# EAGLE schematic External Diagram FH (EAGLE 9.2.2)
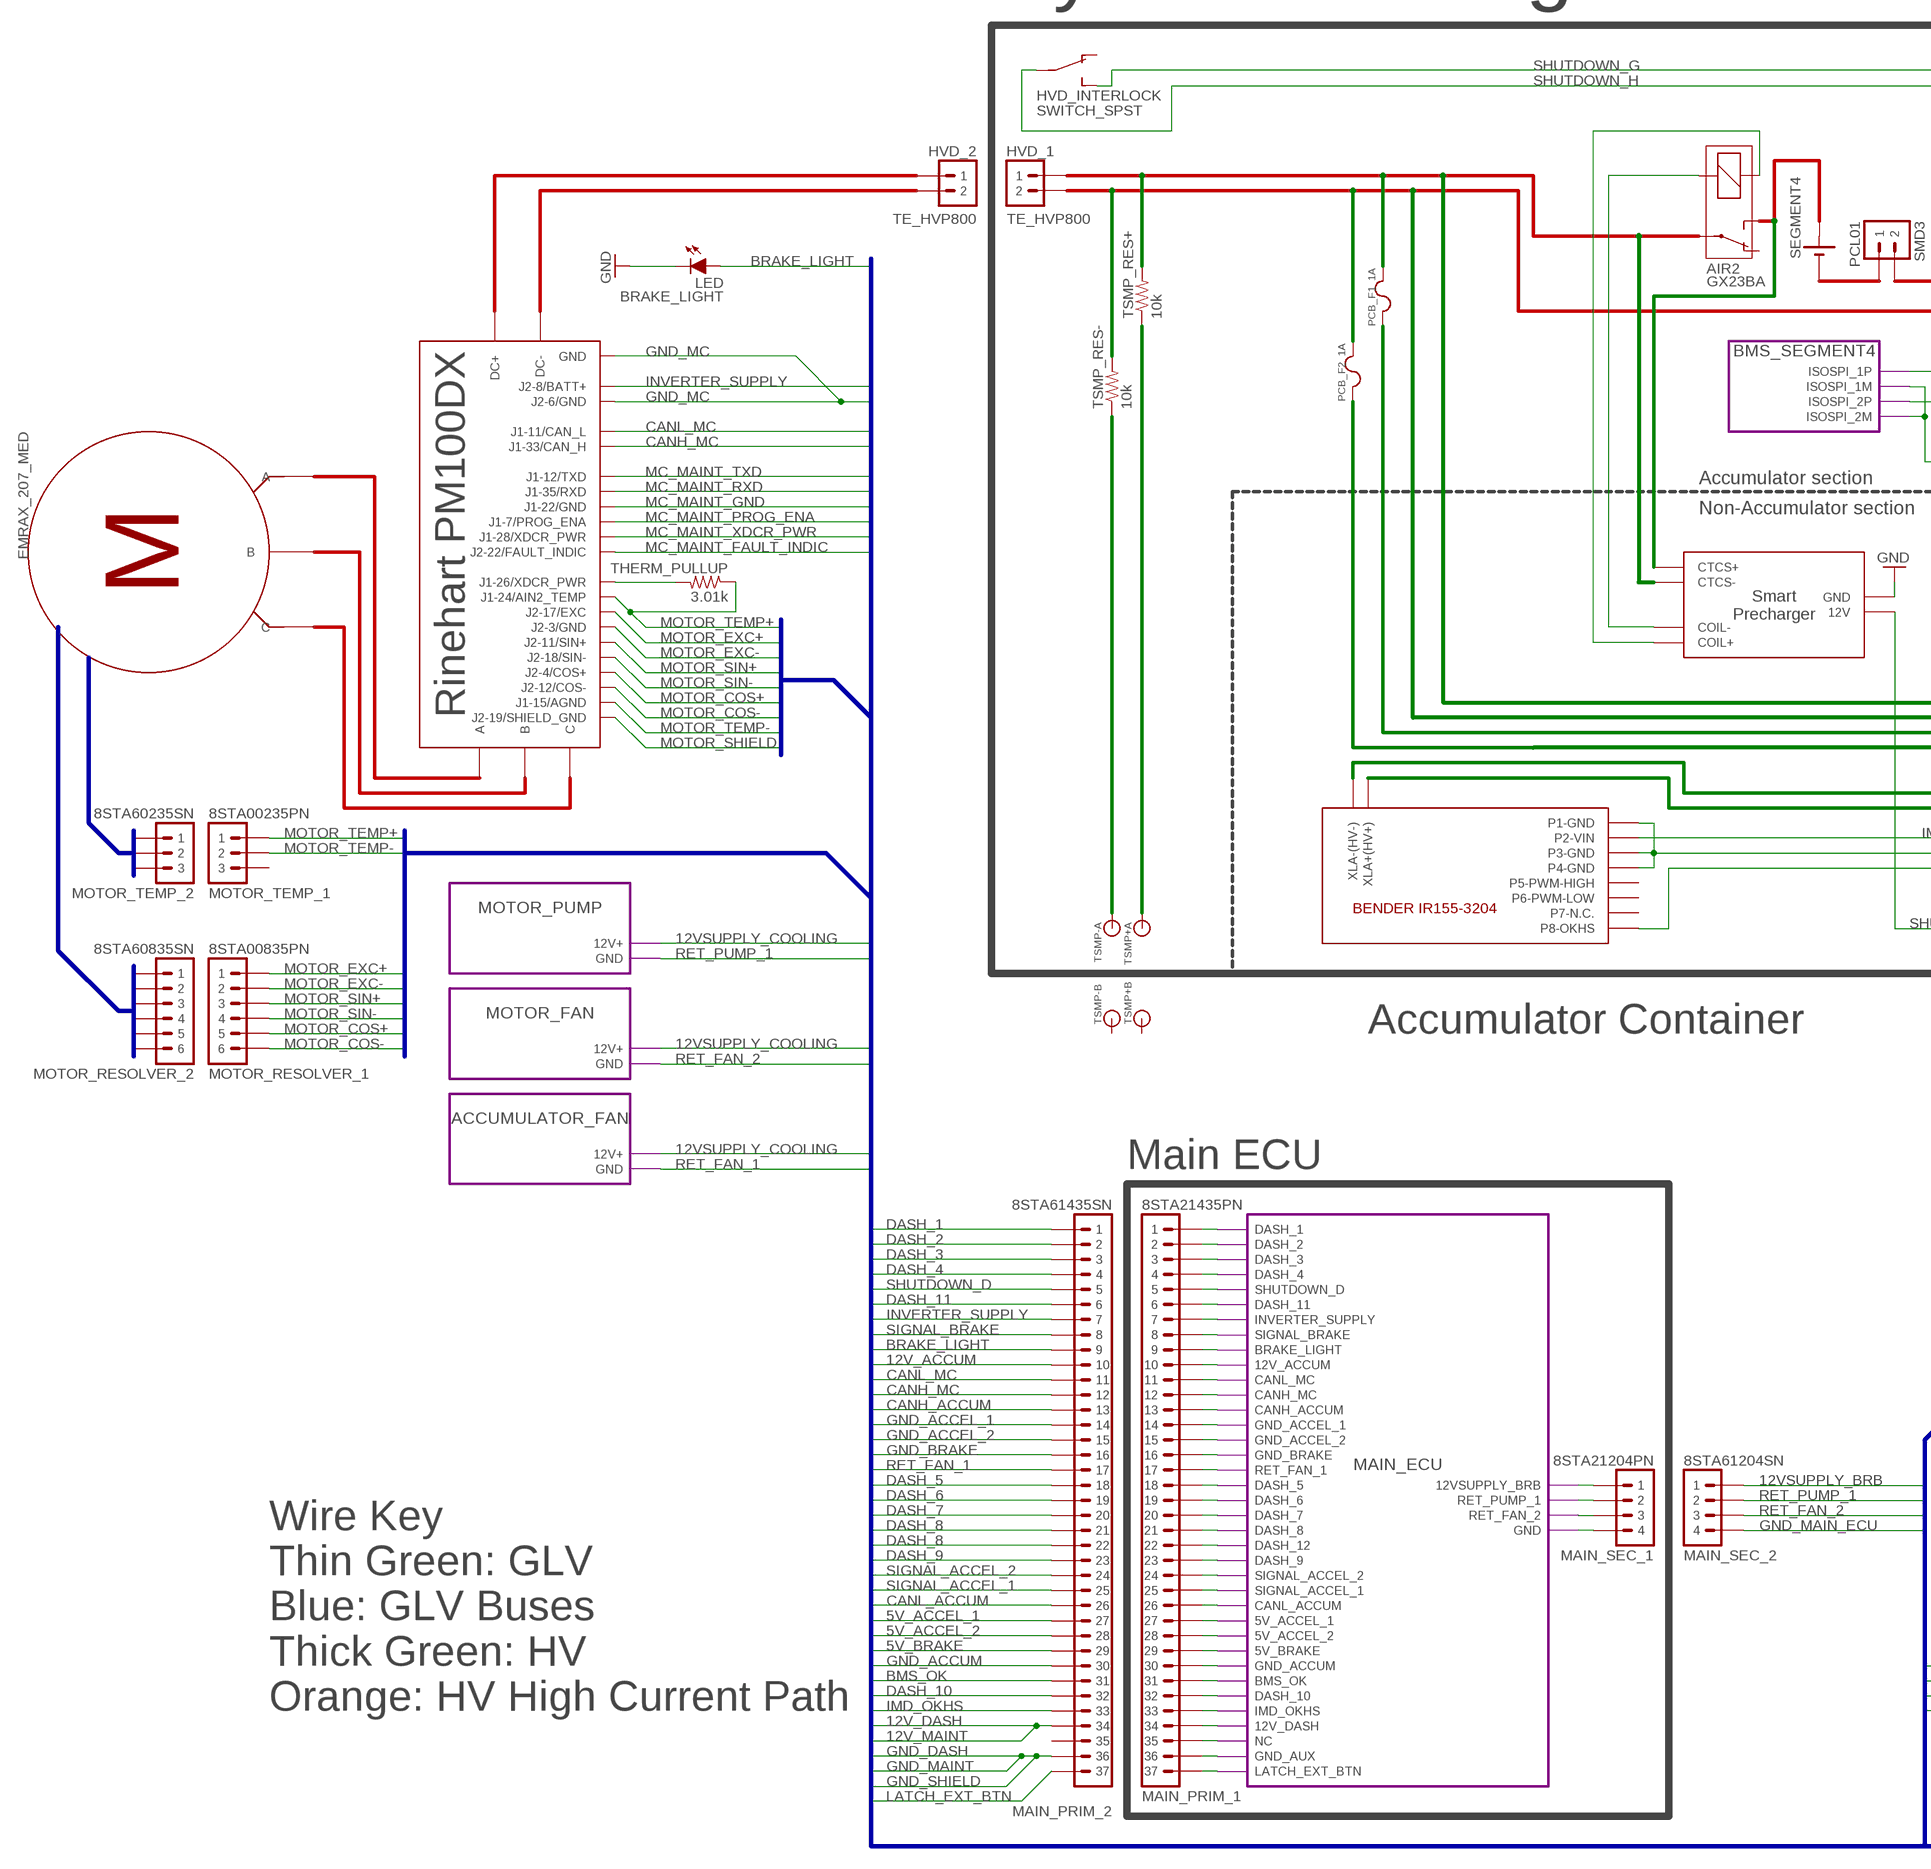
[diagram p0: schematic, sheet 1, part 1 of 2]
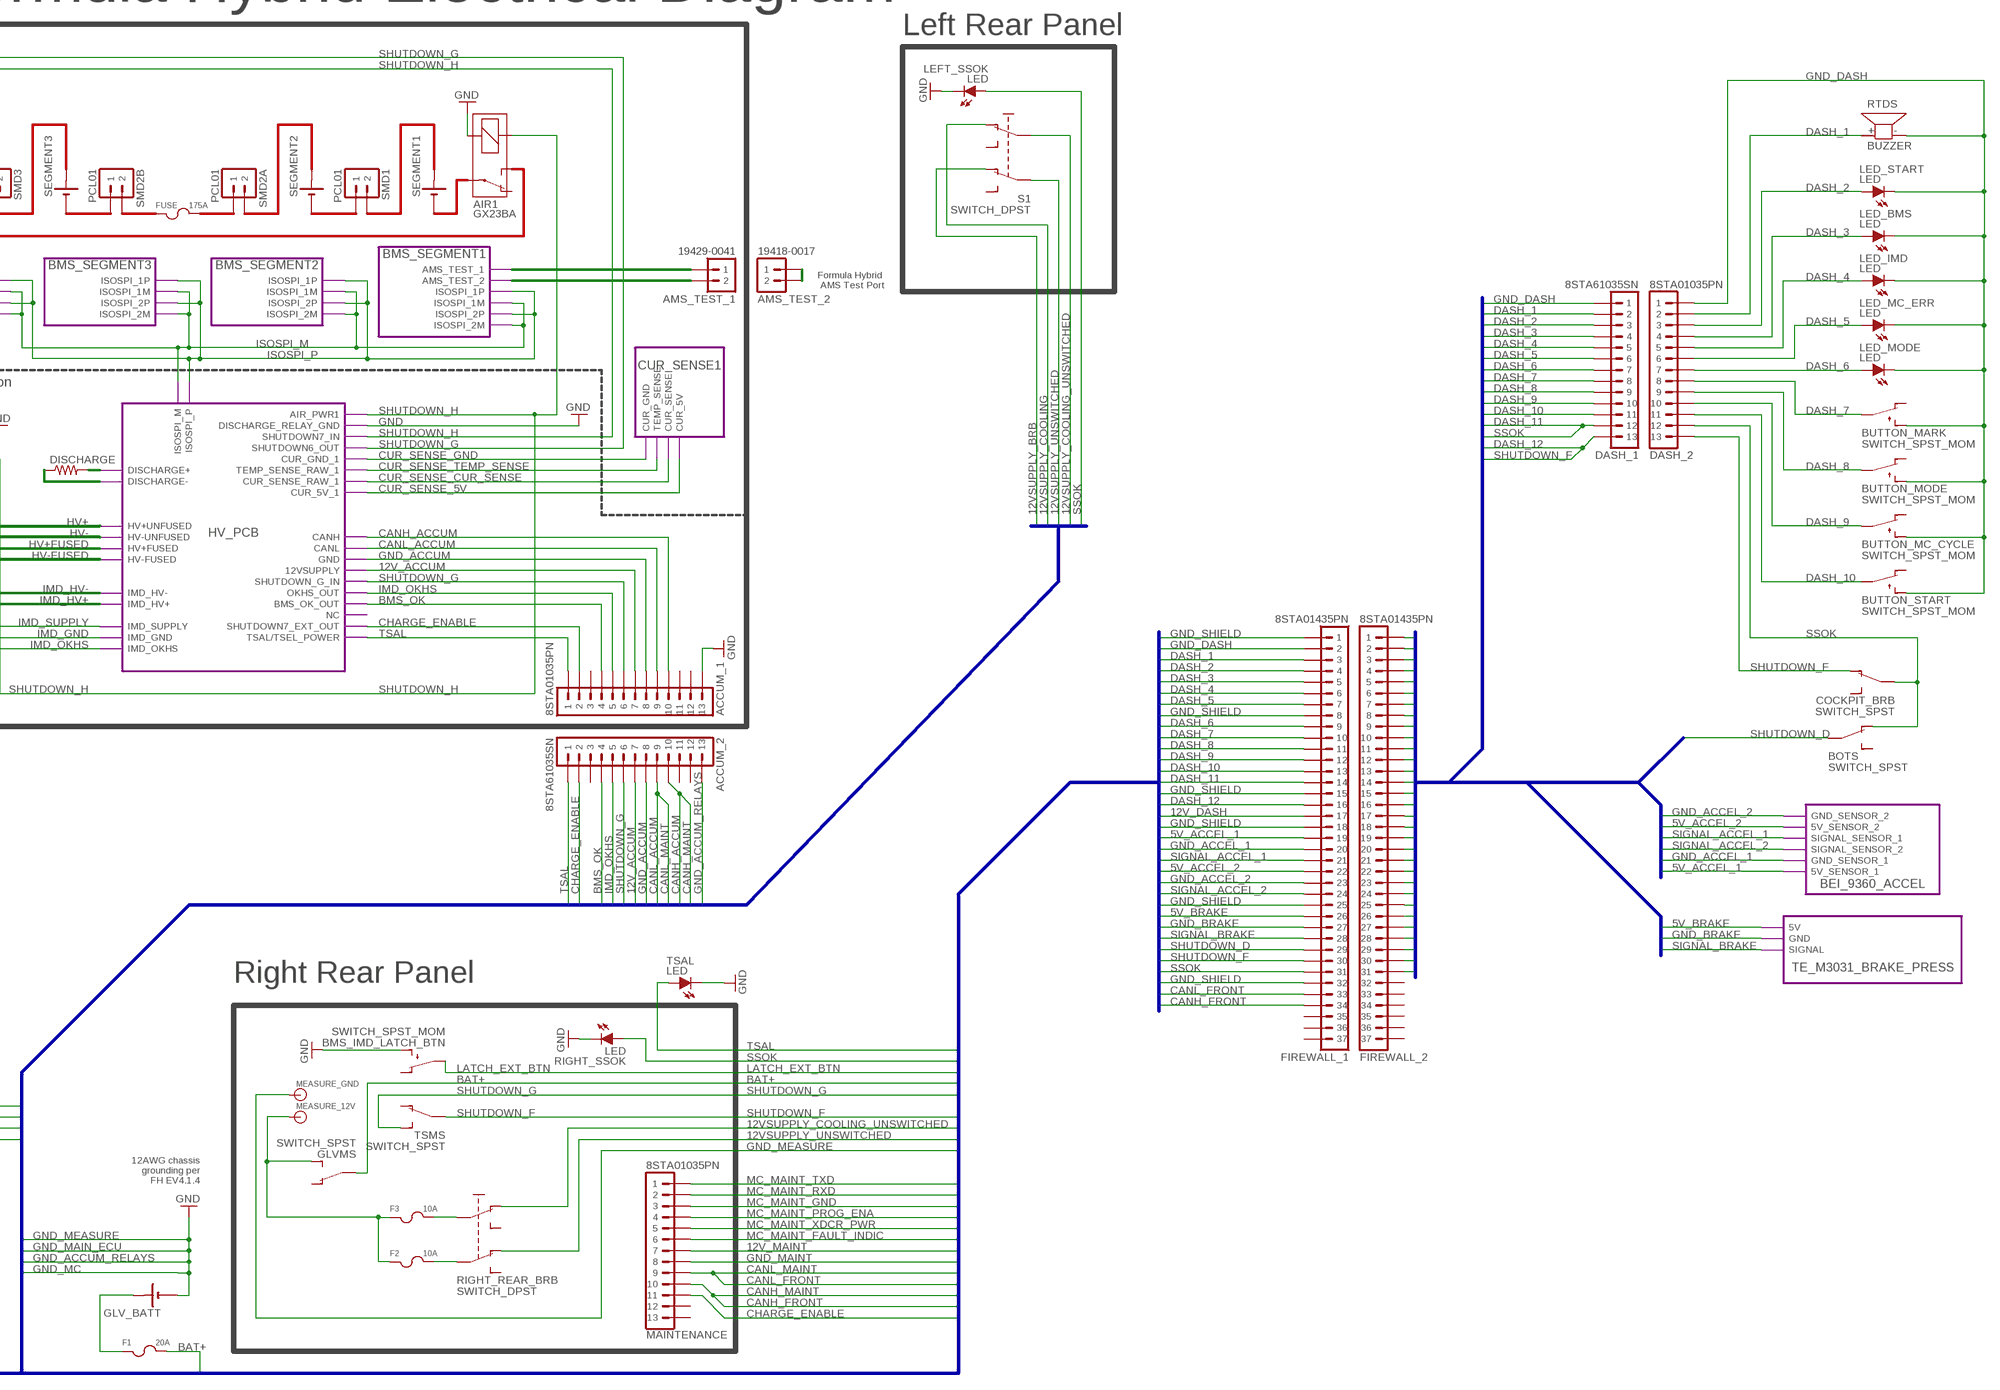
[diagram p1: schematic, sheet 1, part 2 of 2]

## Parts
ACCUM_1  8STA01035PN  M13  (no package)
ACCUM_2  8STA61035SN  M13  (no package)
AIR1  GX23BA  RELAY  (no package)
AIR2  GX23BA  RELAY  (no package)
AMS_TEST_1  19429-0041  M02  (no package)
AMS_TEST_2  19418-0017  M02  (no package)
BMS_IMD_LATCH_BTN  SWITCH_SPST_MOM  (no package)
BOTS  SWITCH_SPST  (no package)
BRAKE_LIGHT  LED  (no package)
BUTTON_MARK  SWITCH_SPST_MOM  (no package)
BUTTON_MC_CYCLE  SWITCH_SPST_MOM  (no package)
BUTTON_MODE  SWITCH_SPST_MOM  (no package)
BUTTON_START  SWITCH_SPST_MOM  (no package)
COCKPIT_BRB  SWITCH_SPST  (no package)
DASH_1  8STA61035SN  M13  (no package)
DASH_2  8STA01035PN  M13  (no package)
DISCHARGE  RESISTOR10W  [10W_RESISTOR_VISHAY]
EMRAX_207_MED  MOTOR_AC  (no package)
F1  20A  FUSE  (no package)
F2  10A  FUSE  (no package)
F3  10A  FUSE  (no package)
FIREWALL_1  8STA01435PN  M37  (no package)
FIREWALL_2  8STA01435PN  M37  (no package)
FUSE  175A  FUSE  (no package)
GLV_BATT  BATTERY_1_CELL  (no package)
GLVMS  SWITCH_SPST  (no package)
HVD_1  TE_HVP800  M02  (no package)
HVD_2  TE_HVP800  M02  (no package)
HVD_INTERLOCK  SWITCH_SPST  (no package)
LED_BMS  LED  (no package)
LED_IMD  LED  (no package)
LED_MC_ERR  LED  (no package)
LED_MODE  LED  (no package)
LED_START  LED  (no package)
LEFT_SSOK  LED  (no package)
MAIN_PRIM_1  8STA21435PN  M37  (no package)
MAIN_PRIM_2  8STA61435SN  M37  (no package)
MAIN_SEC_1  8STA21204PN  M04  (no package)
MAIN_SEC_2  8STA61204SN  M04  (no package)
MAINTENANCE  8STA01035PN  M13  (no package)
MEASURE_12V  BANANA_JACK  (no package)
MEASURE_GND  BANANA_JACK  (no package)
MOTOR_RESOLVER_1  8STA00835PN  M06  (no package)
MOTOR_RESOLVER_2  8STA60835SN  M06  (no package)
MOTOR_TEMP_1  8STA00235PN  M03  (no package)
MOTOR_TEMP_2  8STA60235SN  M03  (no package)
PCB_F1  1A  FUSE  (no package)
PCB_F2  1A  FUSE  (no package)
RIGHT_REAR_BRB  SWITCH_DPST  (no package)
RIGHT_SSOK  LED  (no package)
RTDS  BUZZER  (no package)
S1  SWITCH_DPST  (no package)
SEGMENT1  BATTERY_1_CELL  (no package)
SEGMENT2  BATTERY_1_CELL  (no package)
SEGMENT3  BATTERY_1_CELL  (no package)
SEGMENT4  BATTERY_1_CELL  (no package)
SMD1  PCL01  M02  (no package)
SMD2A  PCL01  M02  (no package)
SMD2B  PCL01  M02  (no package)
SMD3  PCL01  M02  (no package)
THERM_PULLUP  3.01k  RESISTORAXIAL-0.3  [AXIAL-0.3]
TSAL  LED  (no package)
TSMP+A  BANANA_JACK  (no package)
TSMP+B  BANANA_JACK  (no package)
TSMP-A  BANANA_JACK  (no package)
TSMP-B  BANANA_JACK  (no package)
TSMP_RES+  10k  RESISTOR10W  [10W_RESISTOR_VISHAY]
TSMP_RES-  10k  RESISTOR10W  [10W_RESISTOR_VISHAY]
TSMS  SWITCH_SPST  (no package)
U$1  RINEHART_PM100DX  (no package)
U$2  BENDER_IR155-3204  (no package)
U$3  SMART_PRECHARGER  (no package)

## Module instances
HV_PCB = HV_BOARD
BMS_SEGMENT2 = BMS_SEGMENT
BMS_SEGMENT3 = BMS_SEGMENT
BMS_SEGMENT4 = BMS_SEGMENT
MOTOR_PUMP = COOLING_MODULE
MOTOR_FAN = COOLING_MODULE
ACCUMULATOR_FAN = COOLING_MODULE
CUR_SENSE1 = CUR_SENSE
BMS_SEGMENT1 = BMS_SEGMENT_TEST
MAIN_ECU = MAIN_ECU
BEI_9360_ACCEL = BEI_9360
TE_M3031_BRAKE_PRESS = TE_M3031

## Nets
5V_ACCEL_1: FIREWALL_1.19 FIREWALL_2.19 MAIN_PRIM_1.27 MAIN_PRIM_2.27 ; port MAIN_ECU.5V_ACCEL_1 BEI_9360_ACCEL.5V_SENSOR_1
5V_ACCEL_2: FIREWALL_1.22 FIREWALL_2.22 MAIN_PRIM_1.28 MAIN_PRIM_2.28 ; port MAIN_ECU.5V_ACCEL_2 BEI_9360_ACCEL.5V_SENSOR_2
5V_BRAKE: FIREWALL_1.26 FIREWALL_2.26 MAIN_PRIM_1.29 MAIN_PRIM_2.29 ; port MAIN_ECU.5V_BRAKE TE_M3031_BRAKE_PRESS.5V
12V_ACCUM: ACCUM_1.7 ACCUM_2.7 MAIN_PRIM_1.10 MAIN_PRIM_2.10 ; port MAIN_ECU.12V_ACCUM HV_PCB.12VSUPPLY
12V_DASH: FIREWALL_1.17 FIREWALL_2.17 MAIN_PRIM_1.34 MAIN_PRIM_2.34 ; port MAIN_ECU.12V_DASH
12V_MAINT: MAINTENANCE.7
12VSUPPLY_BRB: MAIN_SEC_1.1 MAIN_SEC_2.1 S1.O1 ; port MAIN_ECU.12VSUPPLY_BRB
12VSUPPLY_COOLING: S1.O ; port MOTOR_PUMP.12V+ ACCUMULATOR_FAN.12V+ MOTOR_FAN.12V+
12VSUPPLY_COOLING_UNSWITCHED: RIGHT_REAR_BRB.O S1.P
12VSUPPLY_UNSWITCHED: RIGHT_REAR_BRB.O1 S1.P1
BAT+: F1.2 GLVMS.P
BMS_OK: ACCUM_1.4 ACCUM_2.4 MAIN_PRIM_1.31 MAIN_PRIM_2.31 ; port HV_PCB.BMS_OK_OUT MAIN_ECU.BMS_OK
BRAKE_LIGHT: BRAKE_LIGHT.A MAIN_PRIM_1.9 MAIN_PRIM_2.9 ; port MAIN_ECU.BRAKE_LIGHT
CANH_ACCUM: ACCUM_1.10 ACCUM_2.10 MAIN_PRIM_1.13 MAIN_PRIM_2.13 ; port MAIN_ECU.CANH_ACCUM HV_PCB.CANH
CANH_FRONT: FIREWALL_1.34
CANH_MAINT: MAINTENANCE.10
CANH_MC: MAIN_PRIM_1.12 MAIN_PRIM_2.12 U$1.J1-33/CAN_H ; port MAIN_ECU.CANH_MC
CANL_ACCUM: ACCUM_1.9 ACCUM_2.9 MAIN_PRIM_1.26 MAIN_PRIM_2.26 ; port MAIN_ECU.CANL_ACCUM HV_PCB.CANL
CANL_FRONT: FIREWALL_1.33
CANL_MAINT: MAINTENANCE.9
CANL_MC: MAIN_PRIM_1.11 MAIN_PRIM_2.11 U$1.J1-11/CAN_L ; port MAIN_ECU.CANL_MC
CHARGE_ENABLE: ACCUM_1.2 ACCUM_2.2 MAINTENANCE.11 ; port HV_PCB.SHUTDOWN7_EXT_OUT
CUR_SENSE_5V: port CUR_SENSE1.CUR_5V HV_PCB.CUR_5V_1
CUR_SENSE_CUR_SENSE: port CUR_SENSE1.CUR_SENSE HV_PCB.CUR_SENSE_RAW_1
CUR_SENSE_GND: port CUR_SENSE1.CUR_GND HV_PCB.CUR_GND_1
CUR_SENSE_TEMP_SENSE: port CUR_SENSE1.TEMP_SENSE HV_PCB.TEMP_SENSE_RAW_1
DASH_1: DASH_1.2 DASH_2.2 FIREWALL_1.3 FIREWALL_2.3 MAIN_PRIM_1.1 MAIN_PRIM_2.1 RTDS.1 ; port MAIN_ECU.DASH_1
DASH_2: DASH_1.3 DASH_2.3 FIREWALL_1.4 FIREWALL_2.4 LED_START.A MAIN_PRIM_1.2 MAIN_PRIM_2.2 ; port MAIN_ECU.DASH_2
DASH_3: DASH_1.4 DASH_2.4 FIREWALL_1.5 FIREWALL_2.5 LED_BMS.A MAIN_PRIM_1.3 MAIN_PRIM_2.3 ; port MAIN_ECU.DASH_3
DASH_4: DASH_1.5 DASH_2.5 FIREWALL_1.6 FIREWALL_2.6 LED_IMD.A MAIN_PRIM_1.4 MAIN_PRIM_2.4 ; port MAIN_ECU.DASH_4
DASH_5: DASH_1.6 DASH_2.6 FIREWALL_1.7 FIREWALL_2.7 LED_MC_ERR.A MAIN_PRIM_1.18 MAIN_PRIM_2.18 ; port MAIN_ECU.DASH_5
DASH_6: DASH_1.7 DASH_2.7 FIREWALL_1.9 FIREWALL_2.9 LED_MODE.A MAIN_PRIM_1.19 MAIN_PRIM_2.19 ; port MAIN_ECU.DASH_6
DASH_7: BUTTON_MARK.P DASH_1.8 DASH_2.8 FIREWALL_1.10 FIREWALL_2.10 MAIN_PRIM_1.20 MAIN_PRIM_2.20 ; port MAIN_ECU.DASH_7
DASH_8: BUTTON_MODE.P DASH_1.9 DASH_2.9 FIREWALL_1.11 FIREWALL_2.11 MAIN_PRIM_1.21 MAIN_PRIM_2.21 MAIN_PRIM_2.22 ; port MAIN_ECU.DASH_8
DASH_9: BUTTON_MC_CYCLE.P DASH_1.10 DASH_2.10 FIREWALL_1.12 FIREWALL_2.12 MAIN_PRIM_1.23 MAIN_PRIM_2.23 ; port MAIN_ECU.DASH_9
DASH_10: BUTTON_START.P DASH_1.11 DASH_2.11 FIREWALL_1.13 FIREWALL_2.13 MAIN_PRIM_1.32 MAIN_PRIM_2.32 ; port MAIN_ECU.DASH_10
DASH_11: DASH_1.12 FIREWALL_1.14 FIREWALL_2.14 MAIN_PRIM_1.6 MAIN_PRIM_2.6 ; port MAIN_ECU.DASH_11
DASH_12: DASH_1.13 FIREWALL_1.16 FIREWALL_2.16 MAIN_PRIM_1.22 ; port MAIN_ECU.DASH_12
GND: ACCUM_1.13 AIR1.2 BMS_IMD_LATCH_BTN.S BRAKE_LIGHT.C GLV_BATT.- LEFT_SSOK.C MAIN_SEC_1.4 RIGHT_SSOK.C TSAL.C U$3.GND ; port HV_PCB.DISCHARGE_RELAY_GND MAIN_ECU.GND
GND_ACCEL_1: FIREWALL_1.20 FIREWALL_2.20 MAIN_PRIM_1.14 MAIN_PRIM_2.14 ; port MAIN_ECU.GND_ACCEL_1 BEI_9360_ACCEL.GND_SENSOR_1
GND_ACCEL_2: FIREWALL_1.23 FIREWALL_2.23 MAIN_PRIM_1.15 MAIN_PRIM_2.15 ; port MAIN_ECU.GND_ACCEL_2 BEI_9360_ACCEL.GND_SENSOR_2
GND_ACCUM: ACCUM_1.8 ACCUM_2.8 MAIN_PRIM_1.30 MAIN_PRIM_2.30 ; port MAIN_ECU.GND_ACCUM HV_PCB.GND
GND_ACCUM_RELAYS: ACCUM_2.13
GND_AUX: MAIN_PRIM_1.36 ; port MAIN_ECU.GND_AUX
GND_BRAKE: FIREWALL_1.27 FIREWALL_2.27 MAIN_PRIM_1.16 MAIN_PRIM_2.16 ; port MAIN_ECU.GND_BRAKE TE_M3031_BRAKE_PRESS.GND
GND_DASH: BUTTON_MARK.S BUTTON_MC_CYCLE.S BUTTON_MODE.S BUTTON_START.S DASH_1.1 DASH_2.1 FIREWALL_1.2 FIREWALL_2.2 LED_BMS.C LED_IMD.C LED_MC_ERR.C LED_MODE.C LED_START.C MAIN_PRIM_2.36 RTDS.2
GND_MAIN_ECU: MAIN_SEC_2.4
GND_MAINT: MAINTENANCE.8
GND_MC: U$1.GND U$1.J2-6/GND
GND_MEASURE: MEASURE_GND.1
GND_SHIELD: FIREWALL_1.1 FIREWALL_1.8 FIREWALL_1.15 FIREWALL_1.18 FIREWALL_1.25 FIREWALL_1.32 FIREWALL_2.1 FIREWALL_2.8 FIREWALL_2.15 FIREWALL_2.18 FIREWALL_2.25
HV+: port HV_PCB.HV+UNFUSED
HV+FUSED: PCB_F1.1 ; port HV_PCB.HV+FUSED
HV-: port HV_PCB.HV-UNFUSED
HV-FUSED: PCB_F2.1 ; port HV_PCB.HV-FUSED
IMD_GND: U$2.P1-GND U$2.P3-GND U$2.P4-GND ; port HV_PCB.IMD_GND
IMD_HV+: U$2.XLA+(HV+) ; port HV_PCB.IMD_HV+
IMD_HV-: U$2.XLA-(HV-) ; port HV_PCB.IMD_HV-
IMD_OKHS: ACCUM_1.5 ACCUM_2.5 MAIN_PRIM_1.33 MAIN_PRIM_2.33 U$2.P8-OKHS ; port HV_PCB.IMD_OKHS MAIN_ECU.IMD_OKHS HV_PCB.OKHS_OUT
IMD_SUPPLY: U$2.P2-VIN ; port HV_PCB.IMD_SUPPLY
INVERTER_SUPPLY: MAIN_PRIM_1.7 MAIN_PRIM_2.7 U$1.J2-8/BATT+ ; port MAIN_ECU.INVERTER_SUPPLY
ISOSPI_M: port HV_PCB.ISOSPI_M BMS_SEGMENT1.ISOSPI_1M BMS_SEGMENT2.ISOSPI_1M BMS_SEGMENT2.ISOSPI_2M BMS_SEGMENT3.ISOSPI_2M BMS_SEGMENT3.ISOSPI_1M BMS_SEGMENT4.ISOSPI_1M BMS_SEGMENT4.ISOSPI_2M BMS_SEGMENT1.ISOSPI_2M
ISOSPI_P: port HV_PCB.ISOSPI_P BMS_SEGMENT1.ISOSPI_1P BMS_SEGMENT2.ISOSPI_1P BMS_SEGMENT2.ISOSPI_2P BMS_SEGMENT3.ISOSPI_1P BMS_SEGMENT3.ISOSPI_2P BMS_SEGMENT4.ISOSPI_1P BMS_SEGMENT4.ISOSPI_2P BMS_SEGMENT1.ISOSPI_2P
LATCH_EXT_BTN: BMS_IMD_LATCH_BTN.P MAIN_PRIM_1.37 MAIN_PRIM_2.37 ; port MAIN_ECU.LATCH_EXT_BTN
MC_MAINT_FAULT_INDIC: MAINTENANCE.6 U$1.J2-22/FAULT_INDIC
MC_MAINT_GND: MAINTENANCE.3 U$1.J1-22/GND
MC_MAINT_PROG_ENA: MAINTENANCE.4 U$1.J1-7/PROG_ENA
MC_MAINT_RXD: MAINTENANCE.2 U$1.J1-35/RXD
MC_MAINT_TXD: MAINTENANCE.1 U$1.J1-12/TXD
MC_MAINT_XDCR_PWR: MAINTENANCE.5 U$1.J1-28/XDCR_PWR
MOTOR_COS+: MOTOR_RESOLVER_1.5 U$1.J2-4/COS+
MOTOR_COS-: MOTOR_RESOLVER_1.6 U$1.J2-12/COS-
MOTOR_EXC+: MOTOR_RESOLVER_1.1 U$1.J2-17/EXC
MOTOR_EXC-: MOTOR_RESOLVER_1.2 U$1.J2-3/GND
MOTOR_SHIELD: U$1.J2-19/SHIELD_GND
MOTOR_SIN+: MOTOR_RESOLVER_1.3 U$1.J2-11/SIN+
MOTOR_SIN-: MOTOR_RESOLVER_1.4 U$1.J2-18/SIN-
MOTOR_TEMP+: MOTOR_TEMP_1.1 THERM_PULLUP.P$1 U$1.J1-24/AIN2_TEMP
MOTOR_TEMP-: MOTOR_TEMP_1.2 U$1.J1-15/AGND
N$7: F2.2 RIGHT_REAR_BRB.P1
N$10: AMS_TEST_2.1 AMS_TEST_2.2
N$11: AMS_TEST_1.1 ; port BMS_SEGMENT1.AMS_TEST_1
N$16: F3.2 RIGHT_REAR_BRB.P
N$17: THERM_PULLUP.P$2 U$1.J1-26/XDCR_PWR
N$20: TSMP-A.1 TSMP_RES-.1
N$24: DISCHARGE.1 ; port HV_PCB.DISCHARGE-
N$25: DISCHARGE.2 ; port HV_PCB.DISCHARGE+
N$34: TSMP+A.1 TSMP_RES+.1
N$35: AMS_TEST_1.2 ; port BMS_SEGMENT1.AMS_TEST_2
N$39: TSMP_RES-.2
N$40: TSMP_RES+.2
N$42: U$3.CTCS-
N$45: AIR2.2 U$3.COIL-
N$51: PCB_F1.2
N$52: PCB_F2.2
N$54: AIR2.1 U$3.COIL+
N$60: U$3.CTCS+
N$68: F1.1 GLV_BATT.+
N$74: F2.1 F3.1 GLVMS.S MEASURE_12V.1
N$77: MAIN_PRIM_1.35 ; port MAIN_ECU.NC
RET_FAN_1: MAIN_PRIM_1.17 MAIN_PRIM_2.17 ; port MAIN_ECU.RET_FAN_1 ACCUMULATOR_FAN.GND
RET_FAN_2: MAIN_SEC_1.3 MAIN_SEC_2.3 ; port MAIN_ECU.RET_FAN_2 MOTOR_FAN.GND
RET_PUMP_1: MAIN_SEC_1.2 MAIN_SEC_2.2 ; port MAIN_ECU.RET_PUMP_1 MOTOR_PUMP.GND
SHUTDOWN_D: BOTS.P FIREWALL_1.29 FIREWALL_2.29 MAIN_PRIM_1.5 MAIN_PRIM_2.5 ; port MAIN_ECU.SHUTDOWN_D
SHUTDOWN_F: COCKPIT_BRB.O DASH_2.13 FIREWALL_1.30 FIREWALL_2.30 TSMS.P
SHUTDOWN_G: ACCUM_1.6 ACCUM_2.6 HVD_INTERLOCK.S TSMS.S ; port HV_PCB.SHUTDOWN_G_IN HV_PCB.SHUTDOWN6_OUT
SHUTDOWN_H: AIR1.1 HVD_INTERLOCK.P U$3.12V ; port HV_PCB.SHUTDOWN7_IN HV_PCB.AIR_PWR1
SIGNAL_ACCEL_1: FIREWALL_1.21 FIREWALL_2.21 MAIN_PRIM_1.25 MAIN_PRIM_2.25 ; port MAIN_ECU.SIGNAL_ACCEL_1 BEI_9360_ACCEL.SIGNAL_SENSOR_1
SIGNAL_ACCEL_2: FIREWALL_1.24 FIREWALL_2.24 MAIN_PRIM_1.24 MAIN_PRIM_2.24 ; port MAIN_ECU.SIGNAL_ACCEL_2 BEI_9360_ACCEL.SIGNAL_SENSOR_2
SIGNAL_BRAKE: FIREWALL_1.28 FIREWALL_2.28 MAIN_PRIM_1.8 MAIN_PRIM_2.8 ; port MAIN_ECU.SIGNAL_BRAKE TE_M3031_BRAKE_PRESS.SIGNAL
SSOK: BOTS.O COCKPIT_BRB.P DASH_2.12 FIREWALL_1.31 FIREWALL_2.31 LEFT_SSOK.A RIGHT_SSOK.A
TSAL: ACCUM_1.1 ACCUM_2.1 TSAL.A ; port HV_PCB.TSAL/TSEL_POWER
Unconnected: ACCUM_1.3 ACCUM_1.11 ACCUM_1.12 ACCUM_2.3 ACCUM_2.11 ACCUM_2.12 AIR1.O AIR1.P AIR1.S AIR2.O AIR2.P AIR2.S BMS_IMD_LATCH_BTN.O BOTS.S BUTTON_MARK.O BUTTON_MC_CYCLE.O BUTTON_MODE.O BUTTON_START.O COCKPIT_BRB.S EMRAX_207_MED.A EMRAX_207_MED.B EMRAX_207_MED.C FIREWALL_1.35 FIREWALL_1.36 FIREWALL_1.37 FIREWALL_2.32 FIREWALL_2.33 FIREWALL_2.34 FIREWALL_2.35 FIREWALL_2.36 FIREWALL_2.37 FUSE.1 FUSE.2 GLVMS.O HVD_1.1 HVD_1.2 HVD_2.1 HVD_2.2 HVD_INTERLOCK.O MAIN_PRIM_2.35 MAINTENANCE.12 MAINTENANCE.13 MOTOR_RESOLVER_2.1 MOTOR_RESOLVER_2.2 MOTOR_RESOLVER_2.3 MOTOR_RESOLVER_2.4 MOTOR_RESOLVER_2.5 MOTOR_RESOLVER_2.6 MOTOR_TEMP_1.3 MOTOR_TEMP_2.1 MOTOR_TEMP_2.2 MOTOR_TEMP_2.3 RIGHT_REAR_BRB.S RIGHT_REAR_BRB.S1 S1.S S1.S1 SEGMENT1.+ SEGMENT1.- SEGMENT2.+ SEGMENT2.- SEGMENT3.+ SEGMENT3.- SEGMENT4.+ SEGMENT4.- SMD1.1 SMD1.2 SMD2A.1 SMD2A.2 SMD2B.1 SMD2B.2 SMD3.1 SMD3.2 TSMP+B.1 TSMP-B.1 TSMS.O U$1.A U$1.B U$1.C U$1.DC+ U$1.DC- U$2.P5-PWM-HIGH U$2.P6-PWM-LOW U$2.P7-N.C.

## Buses
5V_ACCEL_1,5V_ACCEL_2,5V_BRAKE,12V_ACCUM,12V_DASH,12V_MAINT,12VSUPPLY_BRB,12VSUPPLY_COOLING,12VSUPPLY_COOLING_UNSWITCHED,12VSUPPLY_UNSWITCHED,BAT+,BMS_OK,BRAKE_LIGHT,CANH_ACCUM,CANH_FRONT,CANH_MAINT,CANH_MC,CANL_ACCUM,CANL_FRONT,CANL_MAINT,CANL_MC,CHARGE_ENABLE,DASH_1,DASH_2,DASH_3,DASH_4,DASH_5,DASH_6,DASH_7,DASH_8,DASH_9,DASH_10,DASH_11,DASH_12,GND_ACCEL_1,GND_ACCEL_2,GND_ACCUM,GND_ACCUM_RELAYS,GND_BRAKE,GND_DASH,GND_MAIN_ECU,GND_MAINT,GND_MC,GND_MEASURE,GND_SHIELD,IMD_OKHS,INVERTER_SUPPLY,LATCH_EXT_BTN,MC_MAINT_FAULT_INDIC,MC_MAINT_GND,MC_MAINT_PROG_ENA,MC_MAINT_RXD,MC_MAINT_TXD,MC_MAINT_XDCR_PWR,MOTOR_COS-,MOTOR_COS+,MOTOR_EXC-,MOTOR_EXC+,MOTOR_SHIELD,MOTOR_SIN-,MOTOR_SIN+,MOTOR_TEMP-,MOTOR_TEMP+,RET_FAN_1,RET_FAN_2,RET_PUMP_1,SHUTDOWN_D,SHUTDOWN_F,SHUTDOWN_G,SIGNAL_ACCEL_1,SIGNAL_ACCEL_2,SIGNAL_BRAKE,SSOK,TSAL
B$1
B$2

## Notes on the sheet
- HyTech Racing 2019 Formula Hybrid Electrical Diagram
- Left Rear Panel
- ⬅ Formula Hybrid
       AMS Test Port
- Accumulator section
- Non-Accumulator section
- Accumulator Container
- Main ECU
- Right Rear Panel
- 12AWG chassis
  grounding per
  FH EV4.1.4
- Wire Key
  Thin Green: GLV
  Blue: GLV Buses
  Thick Green: HV
  Orange: HV High Current Path

## Library data of the parts
ACCUM_1 ACCUM_2 DASH_1 DASH_2 MAINTENANCE = HyTechSymbols:M13: Generic 13-pin connector
AIR1 AIR2 = HyTechSymbols:RELAY: RELAY 1 x switch
AMS_TEST_1 AMS_TEST_2 HVD_1 HVD_2 SMD1 SMD2A SMD2B SMD3 = HyTechSymbols:M02: Generic 2-pin connector
BMS_IMD_LATCH_BTN BUTTON_MARK BUTTON_MC_CYCLE BUTTON_MODE BUTTON_START = HyTechSymbols:SWITCH_SPST_MOM: Single Pull Single Throw Switch Momentary
BOTS COCKPIT_BRB GLVMS HVD_INTERLOCK TSMS = HyTechSymbols:SWITCH_SPST: Single Pull Single Throw Switch
BRAKE_LIGHT LED_BMS LED_IMD LED_MC_ERR LED_MODE LED_START LEFT_SSOK RIGHT_SSOK TSAL = HyTechSymbols:LED: Generic LED
DISCHARGE THERM_PULLUP TSMP_RES+ TSMP_RES- = HyTechDevices:RESISTOR: Resistor Basic schematic elements and footprints for 0603, 1206, and PTH resistors.
EMRAX_207_MED = HyTechSymbols:MOTOR_AC: Generic three-phase AC electric motor
F1-F3 FUSE PCB_F1 PCB_F2 = HyTechSymbols:FUSE: Generic Fuse
FIREWALL_1 FIREWALL_2 MAIN_PRIM_1 MAIN_PRIM_2 = HyTechSymbols:M37: Generic 37-pin connector
GLV_BATT SEGMENT1-SEGMENT4 = HyTechSymbols:BATTERY_1_CELL: Generic 1-cell battery Source: Sonnenschein
MAIN_SEC_1 MAIN_SEC_2 = HyTechSymbols:M04: Generic 4-pin connector
MEASURE_12V MEASURE_GND TSMP+A TSMP+B TSMP-A TSMP-B = HyTechSymbols:BANANA_JACK: Banana Jack Purchasing: Mouser - Red <http://www.mouser.com/ProductDetail/Pomona-Electronics/72930-2/?qs=2nDnb8a6ouM2t6dPw1JBow%3D%3D> Mouser - Black <http://www.mouser.com/ProductDetail/Pomona-Electronics/72930-0/?qs=2nDnb8a6ouNpA2wl9kKnzA%3D%3D>
MOTOR_RESOLVER_1 MOTOR_RESOLVER_2 = HyTechSymbols:M06: Generic 6-pin connector
MOTOR_TEMP_1 MOTOR_TEMP_2 = HyTechSymbols:M03: Generic 3-pin connector
RIGHT_REAR_BRB S1 = HyTechSymbols:SWITCH_DPST: Double Pull Single Throw Switch
RTDS = HyTechSymbols:BUZZER: SPEAKER Prouct Page <http://www.alliedelec.com/icc-intervox-brp4535s-12-c/70115826/> (Ready to Drive Sound) Source: Schukat
U$1 = HyTechSymbols:RINEHART_PM100DX: Rinehart Motion Systems PM100DX Motor Inverter Product Page <http://www.rinehartmotion.com/standard.html> Datasheet <http://www.rinehartmotion.com/uploads/5/1/3/0/51309945/pm100-150datasheet_2.pdf>
U$2 = HyTechSymbols:BENDER_IR155-3204: Bender IR155-3204 Insulation Monitoring Device Datasheet <http://www.bender-es.com/fileadmin/products/doc/IR155-32xx-V004_D00115_D_XXEN.pdf>
U$3 = HyTechSymbols:SMART_PRECHARGER: Smart Precharger http://www.zeva.com.au/Products/datasheets/SmartPrechargerV1-3.pdf

## Module HV_BOARD
Ports: TSAL/TSEL_POWER(out) IMD_SUPPLY(out) IMD_GND(in) IMD_HV+(nc) IMD_HV-(nc) HV+UNFUSED(in) HV-UNFUSED(out) 12VSUPPLY(in) BMS_OK_OUT(out) HV+FUSED(in) HV-FUSED(out) AIR_PWR1(out) SHUTDOWN6_OUT(out) SHUTDOWN7_IN(in) IMD_OKHS(in) OKHS_OUT(out) SHUTDOWN7_EXT_OUT(out) DISCHARGE+(out) DISCHARGE-(in) ISOSPI_P(io) ISOSPI_M(io) CUR_5V_1(out) CUR_SENSE_RAW_1(in) TEMP_SENSE_RAW_1(in) CUR_GND_1(in) DISCHARGE_RELAY_GND(out) GND(out) NC(nc) SHUTDOWN_G_IN(in) CANH(io) CANL(io)

### Library data of the parts

## Module BMS_SEGMENT
Ports: ISOSPI_1M(io) ISOSPI_1P(io) ISOSPI_2P(io) ISOSPI_2M(io)

### Library data of the parts

## Module ENERGY_METER
Ports: HV+IN(in) HV-OUT(in) HV-IN(out) VCC(in) GND(out) IO1(io) IO2(io)

### Library data of the parts

## Module CUR_SENSE
Ports: CUR_GND(out) CUR_SENSE(out) TEMP_SENSE(out) CUR_5V(in)

### Library data of the parts

## Module COOLING_MODULE
Ports: 12V+(in) GND(out)

### Library data of the parts

## Module BMS_SEGMENT_TEST
Ports: AMS_TEST_1(out) AMS_TEST_2(in) ISOSPI_1M(io) ISOSPI_1P(io) ISOSPI_2P(io) ISOSPI_2M(io)

### Library data of the parts

## Module MAIN_ECU
Ports: DASH_1(out) DASH_2(out) DASH_3(out) DASH_4(out) SHUTDOWN_D(out) DASH_11(in) INVERTER_SUPPLY(out) SIGNAL_BRAKE(in) BRAKE_LIGHT(out) 12VSUPPLY_BRB(in) CANL_MC(io) CANH_MC(io) CANH_ACCUM(io) GND_ACCEL_1(in) GND_ACCEL_2(in) GND_BRAKE(in) RET_FAN_1(in) DASH_5(out) DASH_6(out) DASH_7(nc) DASH_8(in) DASH_12(in) DASH_9(in) SIGNAL_ACCEL_2(in) SIGNAL_ACCEL_1(in) CANL_ACCUM(io) 5V_ACCEL_1(out) 5V_ACCEL_2(out) 5V_BRAKE(out) GND_ACCUM(in) BMS_OK(in) DASH_10(in) IMD_OKHS(in) 12V_DASH(in) NC(nc) GND_AUX(in) LATCH_EXT_BTN(out) GND(out) 12V_ACCUM(out) RET_PUMP_1(in) RET_FAN_2(in)

### Library data of the parts

## Module BEI_9360
Ports: GND_SENSOR_2(out) GND_SENSOR_1(out) SIGNAL_SENSOR_1(out) SIGNAL_SENSOR_2(out) 5V_SENSOR_2(in) 5V_SENSOR_1(in)

### Library data of the parts

## Module TE_M3031
Ports: 5V(in) GND(out) SIGNAL(out)

### Library data of the parts